# EAGLE design Motor Servo Driver Rev G (EAGLE 9.6.2)
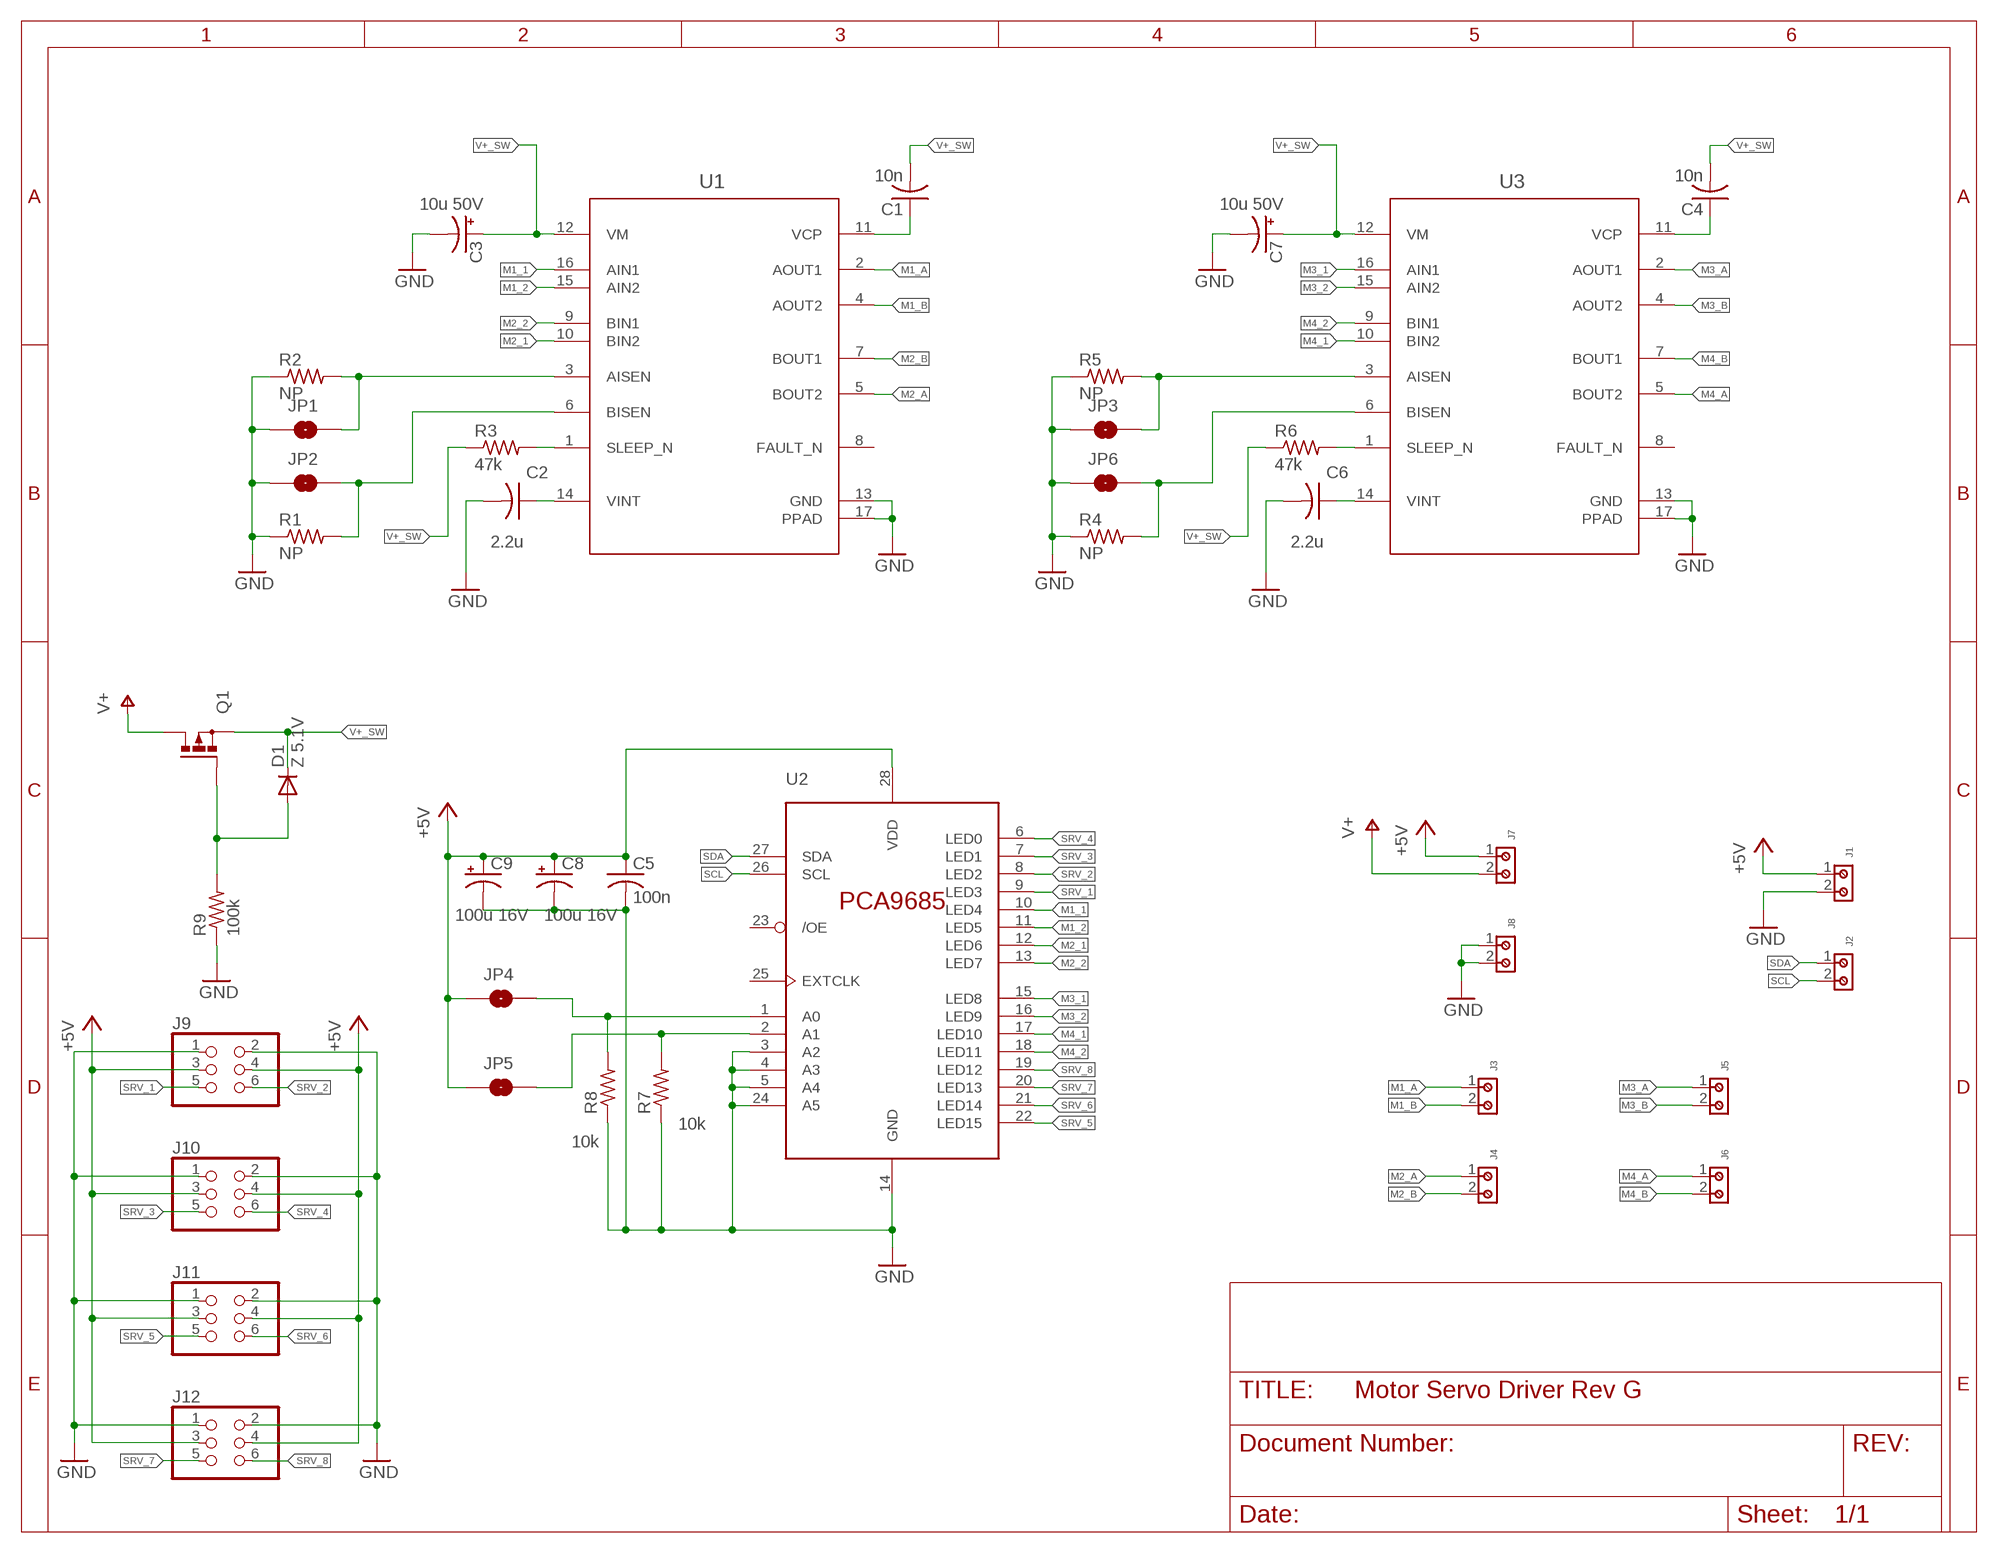
[diagram p0: schematic, sheet 1]

## Parts
C1  10n  CAPACITOR-CERAMIC  [C050-024X044]
C2  2.2u  CAPACITOR-CERAMIC  [C050-024X044]
C3  10u 50V  ELECTROLYTIC-CAPACITOR2.5-5  [E2,5-5]
C4  10n  CAPACITOR-CERAMIC  [C050-024X044]
C5  100n  CAPACITOR-CERAMIC  [C050-024X044]
C6  2.2u  CAPACITOR-CERAMIC  [C050-024X044]
C7  10u 50V  ELECTROLYTIC-CAPACITOR2.5-5  [E2,5-5]
C8  100u 16V  ELECTROLYTIC-CAPACITOR2.5-5  [E2,5-5]
C9  100u 16V  ELECTROLYTIC-CAPACITOR2.5-5  [E2,5-5]
D1  Z 5.1V  1N4000  [DO41-10]
J1  691214110002  [691214110002]
J2  691214110002  [691214110002]
J3  691214110002  [691214110002]
J4  691214110002  [691214110002]
J5  691214110002  [691214110002]
J6  691214110002  [691214110002]
J7  691214110002  [691214110002]
J8  691214110002  [691214110002]
J9  PINHD-2X3  [2X03]
J10  PINHD-2X3  [2X03]
J11  PINHD-2X3  [2X03]
J12  PINHD-2X3  [2X03]
JP1  JUMPER-SMT_2_NO_SILK  [SMT-JUMPER_2_NO_SILK]
JP2  JUMPER-SMT_2_NO_SILK  [SMT-JUMPER_2_NO_SILK]
JP3  JUMPER-SMT_2_NO_SILK  [SMT-JUMPER_2_NO_SILK]
JP4  JUMPER-SMT_2_NO_SILK  [SMT-JUMPER_2_NO_SILK]
JP5  JUMPER-SMT_2_NO_SILK  [SMT-JUMPER_2_NO_SILK]
JP6  JUMPER-SMT_2_NO_SILK  [SMT-JUMPER_2_NO_SILK]
Q1  PMOSFET_PTO220BV  [TO220BV]
R1  NP  R-US_R1206  [R1206]
R2  NP  R-US_R1206  [R1206]
R3  47k  RESISTOR  [0207/10]
R4  NP  R-US_R1206  [R1206]
R5  NP  R-US_R1206  [R1206]
R6  47k  RESISTOR  [0207/10]
R7  10k  RESISTOR  [0207/10]
R8  10k  RESISTOR  [0207/10]
R9  100k  RESISTOR  [0207/10]
U1  Value  DRV8833PWP  [PWP0016C_N]
U2  PCA9685  [TSSOP28]
U3  Value  DRV8833PWP  [PWP0016C_N]

## Nets
+5V: C5.1 C8.+ C9.+ J1.1 J7.1 J9.3 J9.4 J10.3 J10.4 J11.3 J11.4 J12.3 J12.4 JP4.1 JP5.1 U2.28(VDD)
GND: C2.2 C3.- C5.2 C6.2 C7.- C8.- C9.- J1.2 J8.1 J8.2 J9.1 J9.2 J10.1 J10.2 J11.1 J11.2 J12.1 J12.2 JP1.1 JP2.1 JP3.1 JP6.1 R1.1 R2.1 R4.1 R5.1 R7.1 R8.1 R9.1 U1.13(GND) U1.17(PPAD) U2.3(A2) U2.4(A3) U2.5(A4) U2.14(GND) U2.24(A5) U3.13(GND) U3.17(PPAD)
M1_1: U1.16(AIN1) U2.10(LED4)
M1_2: U1.15(AIN2) U2.11(LED5)
M1_A: J3.1 U1.2(AOUT1)
M1_B: J3.2 U1.4(AOUT2)
M2_1: U1.10(BIN2) U2.12(LED6)
M2_2: U1.9(BIN1) U2.13(LED7)
M2_A: J4.1 U1.5(BOUT2)
M2_B: J4.2 U1.7(BOUT1)
M3_1: U2.15(LED8) U3.16(AIN1)
M3_2: U2.16(LED9) U3.15(AIN2)
M3_A: J5.1 U3.2(AOUT1)
M3_B: J5.2 U3.4(AOUT2)
M4_1: U2.17(LED10) U3.10(BIN2)
M4_2: U2.18(LED11) U3.9(BIN1)
M4_A: J6.1 U3.5(BOUT2)
M4_B: J6.2 U3.7(BOUT1)
N$1: JP6.2 R4.2 U3.6(BISEN)
N$2: C2.1 U1.14(VINT)
N$3: D1.A Q1.G R9.2
N$4: JP3.2 R5.2 U3.3(AISEN)
N$5: JP2.2 R1.2 U1.6(BISEN)
N$6: C1.1 U1.11(VCP)
N$7: JP1.2 R2.2 U1.3(AISEN)
N$8: C6.1 U3.14(VINT)
N$9: C4.1 U3.11(VCP)
N$10: R6.2 U3.1(SLEEP_N)
N$15: JP5.2 R7.2 U2.2(A1)
N$16: JP4.2 R8.2 U2.1(A0)
N$18: R3.2 U1.1(SLEEP_N)
SCL: J2.2 U2.26(SCL)
SDA: J2.1 U2.27(SDA)
SRV_1: J9.5 U2.9(LED3)
SRV_2: J9.6 U2.8(LED2)
SRV_3: J10.5 U2.7(LED1)
SRV_4: J10.6 U2.6(LED0)
SRV_5: J11.5 U2.22(LED15)
SRV_6: J11.6 U2.21(LED14)
SRV_7: J12.5 U2.20(LED13)
SRV_8: J12.6 U2.19(LED12)
V+: J7.2 Q1.D
V+_SW: C1.2 C3.+ C4.2 C7.+ D1.C Q1.S R3.1 R6.1 U1.12(VM) U3.12(VM)
Unconnected: U1.8(FAULT_N) U2.23(/OE) U2.25(EXTCLK) U3.8(FAULT_N)

## Library data of the parts
C1 C2 C4-C6 = Quantum Projects:CAPACITOR-CERAMIC
C3 C7-C9 = Quantum Projects:ELECTROLYTIC-CAPACITOR
D1 = Quantum Projects:1N4000
J1-J8 = Wurth_Connectors_WR-TBL Rising Cage Clamp:691214110002: WR-TBL Serie 2141 - 3.50 mm Horiz. Entry Modular KIND PROPERTIES Pitch 3.5 mm MATERIAL PROPERTIES Insulator Material PA66 Insulator Flammability Rating UL94 V-0 Insulator Color Green Contact Material Brass Contact Plating Copper over Zinc Terminal Screw Material Steel Terminal Screw Plating Zinc Wire Guard Material Brass GENERAL INFORMATION Operating Temperature -40 up to +105 °C Compliance Lead free / RoHS ELECTRICAL PROPERTIES IR cULus 10 A Working Voltage [cULus] 300 V (AC) Withstanding Voltage [cULus] 1600 V (AC) Contact Resistance [cULus] 20 mΩ MECHANICAL PROPERTIES Wire Strip Length 5 up to 6 (mm) Screw M2 Solid Wire Section (AWG) 24 to 16 (AWG) Solid Wire Section (Metric) 0.205 to 1.31 (mm²) Stranded Wire Section (AWG) 24 to 16 (AWG) Stranded Wire Section (Metric) 0.205 to 1.31 (mm²) CERTIFICATION cULus Approval E315414 PACKAGING PROPERTIES Packaging Box <https://katalog.we-online.com/media/images/v2/o32858v209%20Family_WR-TBL2_Series2141S.jpg> Details see: https://katalog.we-online.com/en/em/TBL_3_50_2141_HORIZONTAL_ENTRY_MODULAR_69121411000X Updated by Ella Wu 2019-11-12 2019(C) Wurth Elektronik; DATASHEET-URL: https://www.we-online.com/catalog/datasheet/691214110002.pdf; IR-UL: 10A; MOUNT: THT; PART-NUMBER: 691214110002; PINS: 2; PITCH: 3.5mm; TYPE: Horizontal; WIRE: 24 to 16 (AWG) 0.205 to 1.31 (mm²); WORKING-VOLTAGE-UL: 300V (AC)
J9-J12 = pinhead:PINHD-2X3: PIN HEADER
JP1-JP6 = SparkFun-Jumpers:JUMPER-SMT_2_NO: Normally open jumper This jumper has two pads in close proximity to each other. Apply solder to close the connection. Round pads are easier to solder for beginners, but are a lot larger. SparkFun Product that uses the round pads: SparkFun EL Sequencer <https://www.sparkfun.com/products/12781>
Q1 = transistor-power:PMOSFET_P: Power MOSFET P-Channel
R1 R2 R4 R5 = rcl:R-US_: RESISTOR, American symbol; SPICEPREFIX: R
R3 R6-R9 = Quantum Projects:RESISTOR
U1 U3 = Quantum Projects:DRV8833PWP; MANUFACTURER: Texas Instruments; PARTNUMBER: DRV8833PWPR; REFDES: RefDes; TYPE: TYPE
U2 = Quantum Projects:PCA9685

## Board
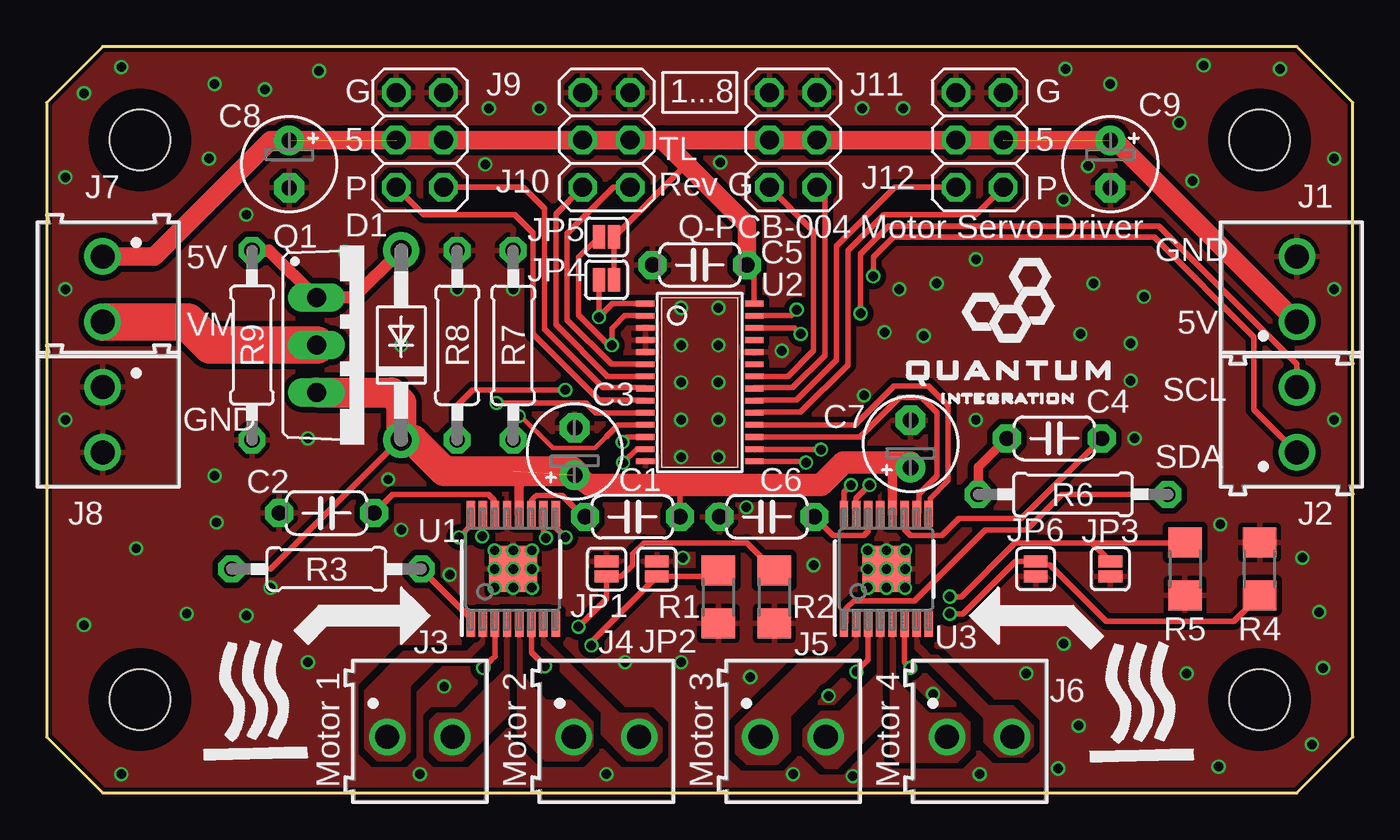
[diagram p1: board, top side]
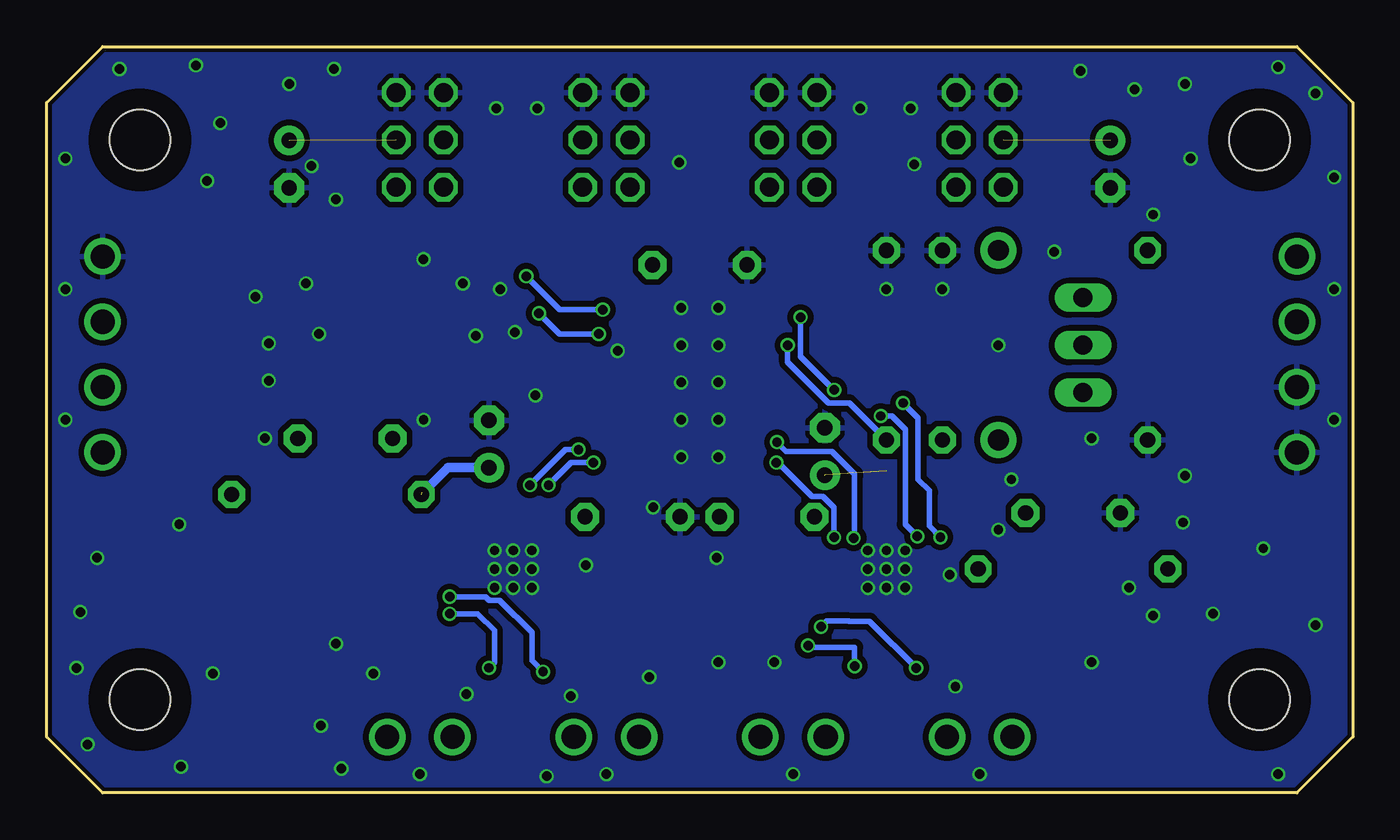
[diagram p2: board, bottom side, seen from below]

Size 70 x 40 mm. Coordinates in mm from the lower left corner, seen from the top.
Outline: 3,0 67,0 70,3 70,37 67,40 3,40 0,37 0,3 3,0
Copper layers (1*16): Top 0.035559375mm / dielectric 1.6mm / Bottom 0.035559375mm
Design rules "jlcpcb2layer *": minimum track width 5mil, minimum drill 12mil, track to track 12mil, track to pad 6mil, pad to pad 6mil, via to via 6mil, smd to smd 5mil, copper to edge 8mil, drill to drill 6mil, minimum pad ring 5mil, minimum via ring 3mil, stop-mask expansion 2.5mil, vias tented up to drill 40mil, thermal gap 10mil
Holes 3.25 mm at 5,35 5,5 65,5 65,35
tRestrict: area 2.2,32.2 to 7.8,37.8; area 2.2,2.2 to 7.8,7.8; area 62.2,2.2 to 67.8,7.8; area 62.2,32.2 to 67.8,37.8
bRestrict: area 2.2,32.2 to 7.8,37.8; area 2.2,2.2 to 7.8,7.8; area 62.2,2.2 to 67.8,7.8; area 62.2,32.2 to 67.8,37.8

### Footprints (pad centres in the part's own frame; a part is rotated, then mirrored left to right if it is on the bottom)
C050-024X044 = drill 0.813 pad 1.5 octagon: 1 -2.54,0; 2 2.54,0
E2,5-5 = drill 0.813 pad 1.6: + -1.27,0 | drill 0.813 pad 1.6 octagon: - 1.27,0
DO41-10 = drill 1.118 pad 1.93: A 5.08,0; C -5.08,0
691214110002 = drill 1.3: 1 -1.75,0; 2 1.75,0
2X03 = drill 1.016 octagon: 1 -2.54,-1.27; 2 -2.54,1.27; 3 0,-1.27; 4 0,1.27; 5 2.54,-1.27; 6 2.54,1.27
SMT-JUMPER_2_NO_SILK = smd 0.635 x 1.27: 1 -0.406,0; 2 0.406,0
TO220BV = drill 1.016 long: D 0,-2.54; G -2.54,-2.54; S 2.54,-2.54
R1206 = smd 1.6 x 1.803: 1 -1.422,0; 2 1.422,0
0207/10 = drill 0.813 pad 1.43 octagon: 1 -5.08,0; 2 5.08,0
PWP0016C_N = smd 1.4 x 0.45: 1 -2.95,2.275; 2 -2.95,1.625; 3 -2.95,0.975; 4 -2.95,0.325; 5 -2.95,-0.325; 6 -2.95,-0.975; 7 -2.95,-1.625; 8 -2.95,-2.275; 9 2.95,-2.275; 10 2.95,-1.625; 11 2.95,-0.975; 12 2.95,-0.325; 13 2.95,0.325; 14 2.95,0.975; 15 2.95,1.625; 16 2.95,2.275 | smd 2.46 x 2.56: 17 0,0 | smd 0.5 x 0.5: V 0.55,-0.55
TSSOP28 = smd 0.305 x 0.991: 1 -4.225,-2.918; 2 -3.575,-2.918; 3 -2.925,-2.918; 4 -2.275,-2.918; 5 -1.625,-2.918; 6 -0.975,-2.918; 7 -0.325,-2.918; 8 0.325,-2.918; 9 0.975,-2.918; 10 1.625,-2.918; 11 2.275,-2.918; 12 2.925,-2.918; 13 3.575,-2.918; 14 4.225,-2.918; 15 4.225,2.918; 16 3.575,2.918; 17 2.925,2.918; 18 2.275,2.918; 19 1.625,2.918; 20 0.975,2.918; 21 0.325,2.918; 22 -0.325,2.918; 23 -0.975,2.918; 24 -1.625,2.918; 25 -2.275,2.918; 26 -2.925,2.918; 27 -3.575,2.918; 28 -4.225,2.918

### Placement (x,y rotation side)
C1  31.4,14.8 0 top
C2  15,15 180 top
C3  28.3,18.3 90 top
C4  54,19 180 top
C5  35,28.3 180 top
C6  38.6,14.8 180 top
C7  46.3,18.7 90 top
C8  13,33.7 270 top
C9  57,33.7 270 top
D1  19,24 90 top
J1  67,27 90 top
J2  67,20 90 top
J3  20,3 0 top
J4  30,3 0 top
J5  40,3 0 top
J6  50,3 0 top
J7  3,27 270 top
J8  3,20 270 top
J9  20,35 270 top
J10  30,35 270 top
J11  40,35 270 top
J12  50,35 270 top
JP1  30,12 270 top
JP2  32.7,12 270 top
JP3  57,12 90 top
JP4  30,27.5 180 top
JP5  30,29.8 180 top
JP6  53,12 90 top
Q1  17,24 270 top
R1  36,10.5 90 top
R2  39,10.5 90 top
R3  15,12 0 top
R4  65,12 270 top
R5  61,12 90 top
R6  55,16 0 top
R7  25,24 270 top
R8  22,24 270 top
R9  11,24 90 top
U1  25,12 90 top
U2  35,22 270 top
U3  45,12 90 top

### Tracks (layer width: path | path; a pad name or v marks a point on that pad's centre or on a via)
+5V  (2 unrouted)
  Top 0.305: U2.28 37.92,27.92 C5.1 | JP4.1 JP5.1 34,33.39 34,34
  Top 1: 33,35 J10.4 J10.3 J9.4 J9.3 16,35 14.5,35 14,35 12,35 5.75,28.75 J7.1 | 33,35 J11.3 J11.4 J12.3 J12.4 57.25,35 J1.1 | 33,35 34,34 37.54,30.46 C5.1
GND  (via drill 0.5, 0.51)
  other vias: 34,26 36,26 36,24 34,24 34,22 36,22 36,20 34,20 34,18 36,18 39.4,23.7 19,24 2,9 4,1 20,1 30,1 40,1 50,1 69,20 69,27 9,38 1,33 1,27 1,20 57,38 62,39 69,34 22,27 25,27 37.5,15.3 31,7 34,7 12,11 9,17 14,7 23.7,36.7 26.4,36.7 43.7,36.7 45.9,36.7 16,29 14,19 55.8,33.6 55.3,3.6 62.8,1.4 61.1,6.4 68.4,6.7 67.8,2.6 58.1,22.1 58.8,26.6 58.1,24.1 55.4,24.6 56.1,27.3 47.7,27.3 45.7,27 44.9,24.7 43.8,21.3 60.7,35.9 11.7,37.7 2,37.5 41.9,5.2 47.5,5.3 52.5,6.4 25,12 45,12 62.9,14.4 67.3,12.6 54.5,8 49.8,20 19,14.1 18.3,16.8 9.1,14.5 4.8,13.1 7.5,9.6 21.3,5.7 43.2,0.9 10.7,31 24,12 25,13 26,12 24,11 25,11 26,11 24,13 26,13 44,13 45,13 46,13 46,12 44,12 44,11 45,11 46,11 34.1,12.6 61.4,32.8 66.1,38.8 47,24.5 49.8,28.6 58.3,19 68.2,9.7 41.1,12.2 21.6,11.7 10.7,9.5 37.7,6.2 54.2,1.3 54.5,31.8 54.6,38.8 23.5,33.7 36.1,33.8 14.6,38.7 8.7,34 4,38.9
  pour Top (rank 2): 3,0 0,3 0,37 3,40 67,40 70,37 70,3 67,0
  pour Bottom (rank 2): 3,0 0,3 0,37 3,40 67,40 70,37 70,3 67,0
M1_1  (via drill 0.5)
  Top 0.305: U1.16 22.73,14.32 v22.1,13.7 | U2.10 29.43,20.38 28.94,20.86 28.91,20.9 28.36,20.9 v24.1,20.9
  Bottom 0.305: v22.1,13.7 22.7,14.3 22.7,16 22.7,16.2 23.3,16.8 23.3,20.1 v24.1,20.9
M1_2  (via drill 0.5)
  Top 0.254: 30,19.1 29.38,18.48 27.13,18.48 25.36,20.26
  Top 0.305: 25.36,20.26 v25.3,20.2 | v23.35,13.76 23.38,13.79 U1.15 | U2.11 30.62,19.73 30,19.1
  Bottom 0.305: v25.3,20.2 24.7,20.2 23.98,19.48 23.98,14.39 v23.35,13.76
M1_A
  pour Top (no thermals): 23.2,9.8 23.2,8.3 22.7,7.8 22.5,7.6 19.1,7.6 17,5.5 17,3 17,2.4 17.7,1.7 19,1.7 19.5,2.2 19.5,3.4 19.5,5.7 20.5,6.7 20.9,7.1 22.6,7.1 23.5,8 23.5,9.2 23.5,9.8
M1_B
  pour Top (no thermals): 24.5,9.8 24.5,6.6 23.2,5.3 22.2,4.3 20.9,4.3 20.5,3.9 20.5,3.7 20.5,2.2 21,1.7 22.3,1.7 22.4,1.8 24.8,4.2 24.8,9.8
M2_1  (via drill 0.5)
  Top 0.305: v30.86,18.8 31.14,19.07 U2.12 | v26.75,13.66 26.62,13.79 U1.10
  Bottom 0.305: 26.7,17 26.7,13.71 v26.75,13.66 | 26.7,17 26.7,17.1 | v30.86,18.8 30.37,18.31 27.91,18.31 26.7,17.1 | 26.7,17.1 26.7,17
M2_2  (via drill 0.5)
  Top 0.305: v27.8,13.7 27.27,14.22 U1.9 | U2.13 31.62,18.43 v30.9,17.7
  Bottom 0.305: v30.9,17.7 30.8,17.7 29,15.9 28.4,15.9 27.8,15.3 v27.8,13.7
M2_A
  pour Top (no thermals): 25.5,9.8 25.5,6.3 26.4,5.4 26.8,5 28.1,5 29.3,3.8 29.3,3.1 29.3,2.5 28.5,1.7 26.7,1.7 26,2.4 25.2,3.2 25.2,9.8
M2_B
  pour Top (no thermals): 26.8,9.8 26.8,8.2 27.3,7.7 30.7,4.3 32.2,4.3 33,3.5 33,3.4 33,2.2 32.9,2.1 32.5,1.7 31.1,1.7 29.7,3.1 29.7,3.2 29.7,4.3 27.5,6.5 27.5,6.9 26.5,7.9 26.5,8.6 26.5,9.8
M3_1  (via drill 0.5)
  Top 0.305: U3.16 42.73,16.12 v43.1,16.5 | v40.7,17.7 40.62,17.77 U2.15
  Bottom 0.305: v43.1,16.5 41.9,17.7 v40.7,17.7
M3_2  (via drill 0.5)
  Top 0.305: U2.16 37.96,18.39 37.97,18.4 v41.5,18.4 | U3.15 43.38,15.78 v44.1,16.5
  Bottom 0.305: v44.1,16.5 42.2,18.4 v41.5,18.4
M3_A
  pour Top (no thermals): 43.2,8.2 43.2,9.8 43.5,9.8 43.5,7.7 39.9,4.1 39.9,2.2 39.2,1.5 37.5,1.5 36.9,2.1 36.9,3.6 40.6,7.3 42.3,7.3
M3_B
  pour Top (no thermals): 44.5,9.8 44.5,6.4 43.3,5.2 42.5,4.4 41.5,4.4 40.5,3.4 40.5,2.5 41.7,1.3 42.4,1.3 43.3,2.2 44.8,3.7 44.8,8.7 44.8,9.8
M4_1
  Top 0.305: U2.17 41.21,19.07 41.22,19.08 41.78,19.08 41.79,19.07 43.58,19.07 45.7,21.2 46.9,21.2 47.7,20.4 47.7,16.99 46.74,16.03 46.74,15.07 U3.10
M4_2
  Top 0.305: U2.18 43.33,19.73 45.41,21.81 47.25,21.81 48.31,20.75 48.31,16.74 47.35,15.78 47.35,14.82 47.2,14.66 47.2,14.4 47.27,14.47 U3.9
M4_A
  pour Top (no thermals): 45.2,9.8 45.2,2 45.6,1.6 48.8,1.6 49.5,2.3 49.5,3.8 49.4,3.9 49,4.3 48.1,4.3 47.3,4.3 46,5.6 45.5,6.1 45.5,8.8 45.5,9.8
M4_B
  pour Top (no thermals): 46.5,9.8 46.5,7.7 47.4,6.8 50.2,4 50.2,3.2 50.2,2.7 51,1.9 52.3,1.9 52.8,2.4 52.9,2.5 52.9,3.6 51.8,4.7 51.1,4.7 50.5,4.7 48.8,6.4 47.8,7.4 47.4,7.4 47,7.8 46.8,8 46.8,8.8 46.8,9.8
N$1  (via drill 0.5, 0.51)
  Top 0.305: U3.6 45.98,7.03 v46.3,6.7 | v48.4,9.6 49.1,9.6 51.91,12.41 JP6.2 53.19,12.22 53.76,12.22 56.78,9.2 63.62,9.2 R4.2
  Bottom 0.305: v46.3,6.7 46,7 46,8.7 46.9,9.6 v48.4,9.6
N$2
  Top 0.305: U1.14 23.98,14.99 23.98,15.7 23.69,15.99 18.54,15.99 C2.1
N$3
  Top 0.635: R9.2 11.92,29.08 Q1.G 16.46,26.54 D1.A
N$4  (via drill 0.5, 0.51)
  Top 0.305: U3.3 44.02,7.12 v43.4,6.5 | v48.4,10.51 49.01,10.51 51.9,13.4 56,13.4 | JP3.2 56.2,13.2 56.01,13.4 56,13.4 | 56,13.4 60.98,13.4 R5.2
  Bottom 0.305: v43.4,6.5 44,7.1 44,8.6 45.72,10.32 46.28,10.32 46.48,10.51 v48.4,10.51
N$5  (via drill 0.51)
  Top 0.305: v26.7,6.8 25.98,7.53 U1.6 | U1.6 | v29.2,7.9 29.2,8.09 JP2.2 35.67,11.59 R1.2
  Bottom 0.305: v26.7,6.8 26.7,7.8 29.1,7.8 v29.2,7.9
N$6
  Top 0.305: C1.1 28.78,14.8 27.63,15.96 26.25,15.96 26.15,15.85 25.98,15.68 U1.11
N$7  (via drill 0.51)
  Top 0.305: 24.02,7.33 23.85,7.15 | 23.85,7.15 v23.4,6.7 | 23.85,7.15 24.02,7.33 | 24.02,7.33 U1.3 | v28.5,8.9 30,10.4 JP1.2 30.79,11.59 31.4,12.2 31.4,12.8 32,13.4 37.52,13.4 R2.2
  Bottom 0.305: v23.4,6.7 25.9,9.2 27,9.2 27.01,9.21 28.19,9.21 v28.5,8.9
N$8
  Top 0.305: U3.14 44.02,14.03 43.8,13.8 42.14,13.8 C6.1
N$9
  Top 0.305: U3.11 45.98,14.12 46.3,13.8 46.31,13.79 47.99,13.79 48.9,14.7 49,14.7 52.24,14.7 C4.1
N$10
  Top 0.305: U3.1 42.84,9.17 42.84,9.88 43.27,10.3 46.51,10.3 50.3,14.09 52.49,14.09 54.4,16 R6.2
N$15  (via drill 0.51)
  Top 0.305: U2.2 30.98,25.57 30.29,24.89 v30.29,24 30.12,24 28.51,25.61 28.51,28.72 JP5.2
  Bottom 0.305: v30.29,24 30.29,23.09 28.1,20.9 26.98,20.9 R7.2
N$16  (via drill 0.51)
  Top 0.305: U2.1 30.32,26.23 v29.6,25.5 JP4.2 | R8.2 21.99,20.75 22.84,21.6 v27.8,21.6
  Bottom 0.305: v29.6,25.5 29.6,23.4 v27.8,21.6
N$18
  Top 0.305: U1.1 22.73,9.36 R3.2
SCL  (via drill 0.51)
  Top 0.305: J2.2 67,23 59.61,30.39 45.12,30.39 43.62,28.89 v43.62,25.7 | v40.41,24.6 40.09,24.93 U2.26
  Bottom 0.305: v43.62,25.7 42.52,24.6 v40.41,24.6
SDA  (via drill 0.51)
  Top 0.305: U2.27 39.88,25.57 v40.2,25.9 | v44.3,27.7 44.3,28.71 45.37,29.78 59.36,29.78 64.7,24.44 64.7,20.55 J2.1
  Bottom 0.305: v40.2,25.9 42.5,25.9 v44.3,27.7
SRV_1
  Top 0.305: J9.5 20.19,31 25.07,31 26.07,30 26.07,24.6 29.6,21.07 32.04,21.07 U2.9
SRV_2
  Top 0.305: J9.6 25.54,32.46 26.68,31.32 26.68,24.85 29.82,21.71 32.04,21.71 U2.8
SRV_3
  Top 0.305: J10.5 27.29,31.02 27.29,25.1 30.07,22.32 U2.7
SRV_4
  Top 0.305: J10.6 30.37,32.46 27.9,29.99 27.9,25.36 30.28,22.98 U2.6
SRV_5
  Top 0.305: J11.5 41.1,30.09 41.1,23.7 39.73,22.32 U2.22
SRV_6
  Top 0.305: U2.21 37.96,21.71 39.98,21.71 41.71,23.45 41.71,32.02 J11.6
SRV_7
  Top 0.305: U2.20 37.96,21.07 40.19,21.07 42.32,23.2 42.32,29.32 45.46,32.46 J12.5
SRV_8
  Top 0.305: U2.19 37.96,20.41 40.4,20.41 42.93,22.94 42.93,29.07 44.86,31 49.81,31 J12.6
V+
  Top 2: J7.2 7.55,25.25 8.8,24 Q1.D
V+_SW  (3 unrouted)
  Top 0.305: C1.2 33.94,16.44 34,16.5 | R3.1 12,12 18.88,18.88 18.96,18.88
  Top 0.5: U1.12 25.32,16.93
  Top 0.508: 25.32,16.93 25,17.25 | U3.12 45.33,17.38 45,17.7 | R6.1 49.92,17.46 C4.2
  Top 1.2: C3.+ 29.08,16.5 34,16.5 41.51,16.5 42.71,17.7 45,17.7 46.28,17.7 C7.+
  Top 1.6: Q1.S 18.46,21.46 19,20.92 D1.C | 18.96,18.88 D1.C | D1.C 19.64,18.92 21.31,17.25 28.11,17.25 28.31,17.04
  Bottom 0.508: C7.+ 48.49,17.43 49.82,16.1 49.9,16.1

### Text on the board
tNames: G | 1...8 | G | 5 | 5 | P | TL / Rev G | P | Q-PCB-004 Motor Servo Driver | 5V | GND | 5V | VM | SCL | GND | SDA | Motor 1 | Motor 2 | Motor 3 | Motor 4